# Altium project DPN_ControlLed.PrjPcb
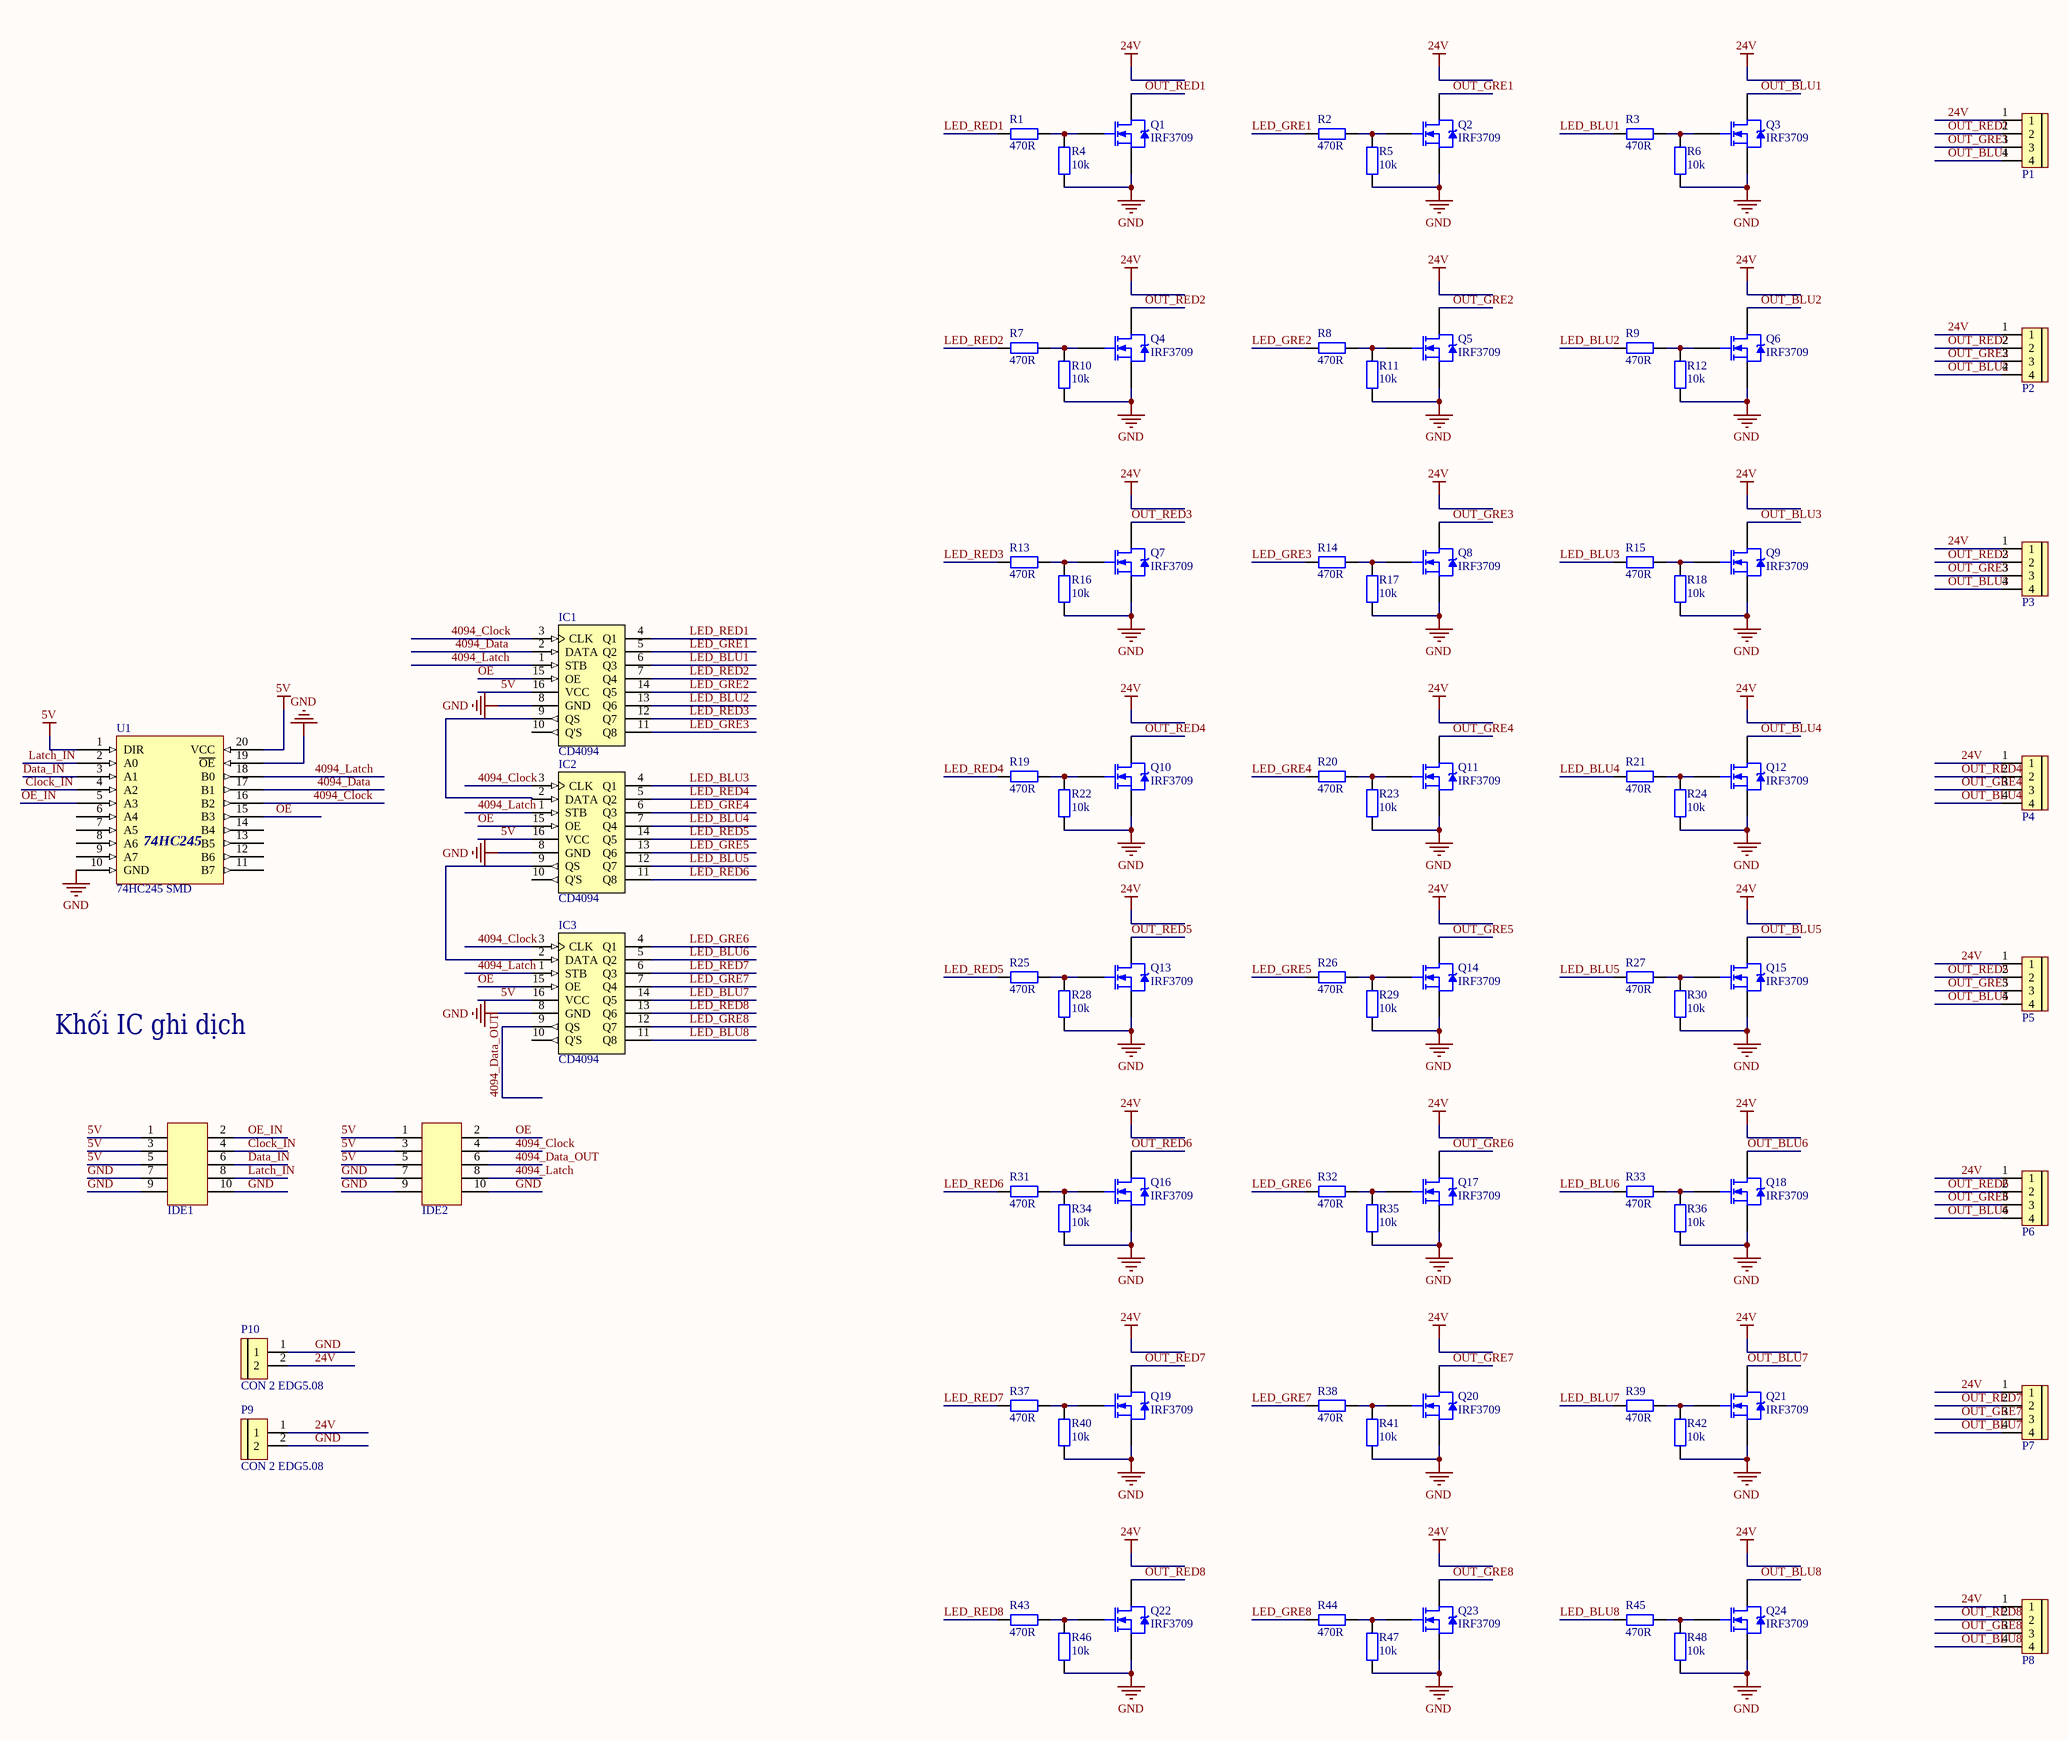
[diagram p0: sche_DPN_ControlLed.SchDoc]
1 sheet, 88 parts. Net scope: global (net labels, ports and power ports of the same name join across sheets).
Board file: pcb_DPN_ControlLed.PcbDoc

## Sheet sche_DPN_ControlLed.SchDoc
size A2

### Parts
IC1  CD4094  [CD4094]
IC2  CD4094  [CD4094]
IC3  CD4094  [CD4094]
IDE1  IDE10  [IDE10_Cong]  (value not drawn)
IDE2  IDE10  [IDE10_Cong]  (value not drawn)
P1  CON 4 EDG5.08  [CON 4 4EDG5.08]  (value not drawn)
P2  CON 4 EDG5.08  [CON 4 4EDG5.08]  (value not drawn)
P3  CON 4 EDG5.08  [CON 4 4EDG5.08]  (value not drawn)
P4  CON 4 EDG5.08  [CON 4 4EDG5.08]  (value not drawn)
P5  CON 4 EDG5.08  [CON 4 4EDG5.08]  (value not drawn)
P6  CON 4 EDG5.08  [CON 4 4EDG5.08]  (value not drawn)
P7  CON 4 EDG5.08  [CON 4 4EDG5.08]  (value not drawn)
P8  CON 4 EDG5.08  [CON 4 4EDG5.08]  (value not drawn)
P9  CON 2 EDG5.08  [CON 2 2EDG5.08]
P10  CON 2 EDG5.08  [CON 2 2EDG5.08]
Q1  IRF3709  [D2PAK]
Q2  IRF3709  [D2PAK]
Q3  IRF3709  [D2PAK]
Q4  IRF3709  [D2PAK]
Q5  IRF3709  [D2PAK]
Q6  IRF3709  [D2PAK]
Q7  IRF3709  [D2PAK]
Q8  IRF3709  [D2PAK]
Q9  IRF3709  [D2PAK]
Q10  IRF3709  [D2PAK]
Q11  IRF3709  [D2PAK]
Q12  IRF3709  [D2PAK]
Q13  IRF3709  [D2PAK]
Q14  IRF3709  [D2PAK]
Q15  IRF3709  [D2PAK]
Q16  IRF3709  [D2PAK]
Q17  IRF3709  [D2PAK]
Q18  IRF3709  [D2PAK]
Q19  IRF3709  [D2PAK]
Q20  IRF3709  [D2PAK]
Q21  IRF3709  [D2PAK]
Q22  IRF3709  [D2PAK]
Q23  IRF3709  [D2PAK]
Q24  IRF3709  [D2PAK]
R1  470R  [Tro SMD 0805]
R2  470R  [Tro SMD 0805]
R3  470R  [Tro SMD 0805]
R4  10k  [tro smd 0805]
R5  10k  [tro smd 0805]
R6  10k  [tro smd 0805]
R7  470R  [Tro SMD 0805]
R8  470R  [Tro SMD 0805]
R9  470R  [Tro SMD 0805]
R10  10k  [tro smd 0805]
R11  10k  [tro smd 0805]
R12  10k  [tro smd 0805]
R13  470R  [Tro SMD 0805]
R14  470R  [Tro SMD 0805]
R15  470R  [Tro SMD 0805]
R16  10k  [tro smd 0805]
R17  10k  [tro smd 0805]
R18  10k  [tro smd 0805]
R19  470R  [Tro SMD 0805]
R20  470R  [Tro SMD 0805]
R21  470R  [Tro SMD 0805]
R22  10k  [tro smd 0805]
R23  10k  [tro smd 0805]
R24  10k  [tro smd 0805]
R25  470R  [Tro SMD 0805]
R26  470R  [Tro SMD 0805]
R27  470R  [Tro SMD 0805]
R28  10k  [tro smd 0805]
R29  10k  [tro smd 0805]
R30  10k  [tro smd 0805]
R31  470R  [Tro SMD 0805]
R32  470R  [Tro SMD 0805]
R33  470R  [Tro SMD 0805]
R34  10k  [tro smd 0805]
R35  10k  [tro smd 0805]
R36  10k  [tro smd 0805]
R37  470R  [Tro SMD 0805]
R38  470R  [Tro SMD 0805]
R39  470R  [Tro SMD 0805]
R40  10k  [tro smd 0805]
R41  10k  [tro smd 0805]
R42  10k  [tro smd 0805]
R43  470R  [Tro SMD 0805]
R44  470R  [Tro SMD 0805]
R45  470R  [Tro SMD 0805]
R46  10k  [tro smd 0805]
R47  10k  [tro smd 0805]
R48  10k  [tro smd 0805]
U1  74HC245 SMD  [SOP 20]

### Nets
5V: IC1.16(VCC) IC2.16(VCC) IC3.16(VCC) IDE1.1 IDE1.3 IDE1.5 IDE2.1 IDE2.3 IDE2.5 U1.1(DIR) U1.20(VCC)
24V: P1.1 P2.1 P3.1 P4.1 P5.1 P6.1 P7.1 P8.1 P9.1 P10.2
GND: IC1.8(GND) IC2.8(GND) IC3.8(GND) IDE1.7 IDE1.9 IDE1.10 IDE2.7 IDE2.9 IDE2.10 P9.2 P10.1 Q1.3(S) Q2.3(S) Q3.3(S) Q4.3(S) Q5.3(S) Q6.3(S) Q7.3(S) Q8.3(S) Q9.3(S) Q10.3(S) Q11.3(S) Q12.3(S) Q13.3(S) Q14.3(S) Q15.3(S) Q16.3(S) Q17.3(S) Q18.3(S) Q19.3(S) Q20.3(S) Q21.3(S) Q22.3(S) Q23.3(S) Q24.3(S) R4.1 R5.1 R6.1 R10.1 R11.1 R12.1 R16.1 R17.1 R18.1 R22.1 R23.1 R24.1 R28.1 R29.1 R30.1 R34.1 R35.1 R36.1 R40.1 R41.1 R42.1 R46.1 R47.1 R48.1 U1.10(GND) U1.19(~{OE})
4094_Clock: IC1.3(CLK) IC2.3(CLK) IC3.3(CLK) IDE2.4 U1.16(B2)
4094_Data: IC1.2(DATA) U1.17(B1)
4094_Data_OUT: IC3.9(QS) IDE2.6
4094_Latch: IC1.1(STB) IC2.1(STB) IC3.1(STB) IDE2.8 U1.18(B0)
Clock_IN: IDE1.4 U1.4(A2)
Data_IN: IDE1.6 U1.3(A1)
Latch_IN: IDE1.8 U1.2(A0)
LED_BLU1: IC1.6(Q3) R3.1
LED_BLU2: IC1.13(Q6) R9.1
LED_BLU3: IC2.4(Q1) R15.1
LED_BLU4: IC2.7(Q4) R21.1
LED_BLU5: IC2.12(Q7) R27.1
LED_BLU6: IC3.5(Q2) R33.1
LED_BLU7: IC3.14(Q5) R39.1
LED_BLU8: IC3.11(Q8) R45.1
LED_GRE1: IC1.5(Q2) R2.1
LED_GRE2: IC1.14(Q5) R8.1
LED_GRE3: IC1.11(Q8) R14.1
LED_GRE4: IC2.6(Q3) R20.1
LED_GRE5: IC2.13(Q6) R26.1
LED_GRE6: IC3.4(Q1) R32.1
LED_GRE7: IC3.7(Q4) R38.1
LED_GRE8: IC3.12(Q7) R44.1
LED_RED1: IC1.4(Q1) R1.1
LED_RED2: IC1.7(Q4) R7.1
LED_RED3: IC1.12(Q7) R13.1
LED_RED4: IC2.5(Q2) R19.1
LED_RED5: IC2.14(Q5) R25.1
LED_RED6: IC2.11(Q8) R31.1
LED_RED7: IC3.6(Q3) R37.1
LED_RED8: IC3.13(Q6) R43.1
OE: IC1.15(OE) IC2.15(OE) IC3.15(OE) IDE2.2 U1.15(B3)
OE_IN: IDE1.2 U1.5(A3)
OUT_BLU1: P1.4 Q3.2(D)
OUT_BLU2: P2.4 Q6.2(D)
OUT_BLU3: P3.4 Q9.2(D)
OUT_BLU4: P4.4 Q12.2(D)
OUT_BLU5: P5.4 Q15.2(D)
OUT_BLU6: P6.4 Q18.2(D)
OUT_BLU7: P7.4 Q21.2(D)
OUT_BLU8: P8.4 Q24.2(D)
OUT_GRE1: P1.3 Q2.2(D)
OUT_GRE2: P2.3 Q5.2(D)
OUT_GRE3: P3.3 Q8.2(D)
OUT_GRE4: P4.3 Q11.2(D)
OUT_GRE5: P5.3 Q14.2(D)
OUT_GRE6: P6.3 Q17.2(D)
OUT_GRE7: P7.3 Q20.2(D)
OUT_GRE8: P8.3 Q23.2(D)
OUT_RED1: P1.2 Q1.2(D)
OUT_RED2: P2.2 Q4.2(D)
OUT_RED3: P3.2 Q7.2(D)
OUT_RED4: P4.2 Q10.2(D)
OUT_RED5: P5.2 Q13.2(D)
OUT_RED6: P6.2 Q16.2(D)
OUT_RED7: P7.2 Q19.2(D)
OUT_RED8: P8.2 Q22.2(D)
NetIC1_9: IC1.9(QS) IC2.2(DATA)
NetIC2_9: IC2.9(QS) IC3.2(DATA)
NetQ1_1: Q1.1(G) R1.2 R4.2
NetQ2_1: Q2.1(G) R2.2 R5.2
NetQ3_1: Q3.1(G) R3.2 R6.2
NetQ4_1: Q4.1(G) R7.2 R10.2
NetQ5_1: Q5.1(G) R8.2 R11.2
NetQ6_1: Q6.1(G) R9.2 R12.2
NetQ7_1: Q7.1(G) R13.2 R16.2
NetQ8_1: Q8.1(G) R14.2 R17.2
NetQ9_1: Q9.1(G) R15.2 R18.2
NetQ10_1: Q10.1(G) R19.2 R22.2
NetQ11_1: Q11.1(G) R20.2 R23.2
NetQ12_1: Q12.1(G) R21.2 R24.2
NetQ13_1: Q13.1(G) R25.2 R28.2
NetQ14_1: Q14.1(G) R26.2 R29.2
NetQ15_1: Q15.1(G) R27.2 R30.2
NetQ16_1: Q16.1(G) R31.2 R34.2
NetQ17_1: Q17.1(G) R32.2 R35.2
NetQ18_1: Q18.1(G) R33.2 R36.2
NetQ19_1: Q19.1(G) R37.2 R40.2
NetQ20_1: Q20.1(G) R38.2 R41.2
NetQ21_1: Q21.1(G) R39.2 R42.2
NetQ22_1: Q22.1(G) R43.2 R46.2
NetQ23_1: Q23.1(G) R44.2 R47.2
NetQ24_1: Q24.1(G) R45.2 R48.2

Not connected (* = marked no-connect by the designer): IC1 10(Q'S); IC2 10(Q'S); IC3 10(Q'S); U1 6(A4) 7(A5) 8(A6) 9(A7) 11(B7) 12(B6) 13(B5) 14(B4)

### Notes on the sheet
- Khối IC ghi dịch
- (in symbol 74HC245 SMD) 74HC245

### Library data of the parts
IC1-IC3 = CD4094 SMD: Dán; Ten_Linh_Kien: CD4094 SOP16; Don_Vi: Con; Ma_Hang: MH002295; Ghi_Chu: *; Kieu_Chan: *; Chung_Loai: Dán
IDE1 IDE2 = IDE 10 DT
P1-P8 = CON 4 EDG5.08: Cắm; Ten_Linh_Kien: CON 4 2EDG5.08-4P 5.08MM ( Xanh Cong); Ma_Hang: MH000979; Don_Vi: Con; Ghi_Chu: *; Kieu_Chan: *; Chung_Loai: Cắm
P9 P10 = CON 2 EDG5.08: Cắm; Ten_Linh_Kien: CON 2 2EDG5.08-2P 5.08MM ( Xanh Cong); Ma_Hang: MH000759; Ghi_Chu: *; Don_Vi: Con; Kieu_Chan: *; Chung_Loai: Cắm
Q1-Q24 = IRF3709S SMD: N-Channel Power MOSFET
R1-R3 R7-R9 R13-R15 R19-R21 R25-R27 R31-R33 R37-R39 R43-R45 = Tro 0805 5% 470R: Dán; Don_Vi: Con; Ma_Hang: MH005341; Ten_Linh_Kien: Trở 0805 5% 470R; So_Chan: 2; Chung_Loai: Dán; Kieu_Chan: *
R4-R6 R10-R12 R16-R18 R22-R24 R28-R30 R34-R36 R40-R42 R46-R48 = Tro 0805 5% 10k: Dán; Don_Vi: Con; So_Chan: 2; Ten_Linh_Kien: Trở 0805 5% 10k; Ma_Hang: MH005239; Chung_Loai: Dán; Kieu_Chan: *
U1 = 74HC245 SMD: Dán; Ten_Linh_Kien: 74HC245DW SSOP20 5.2MM; Don_Vi: Con; Ma_Hang: MH003571; Ghi_Chu: *; Kieu_Chan: *; Chung_Loai: Dán